# Altium project PASS Capstone.PrjPcb
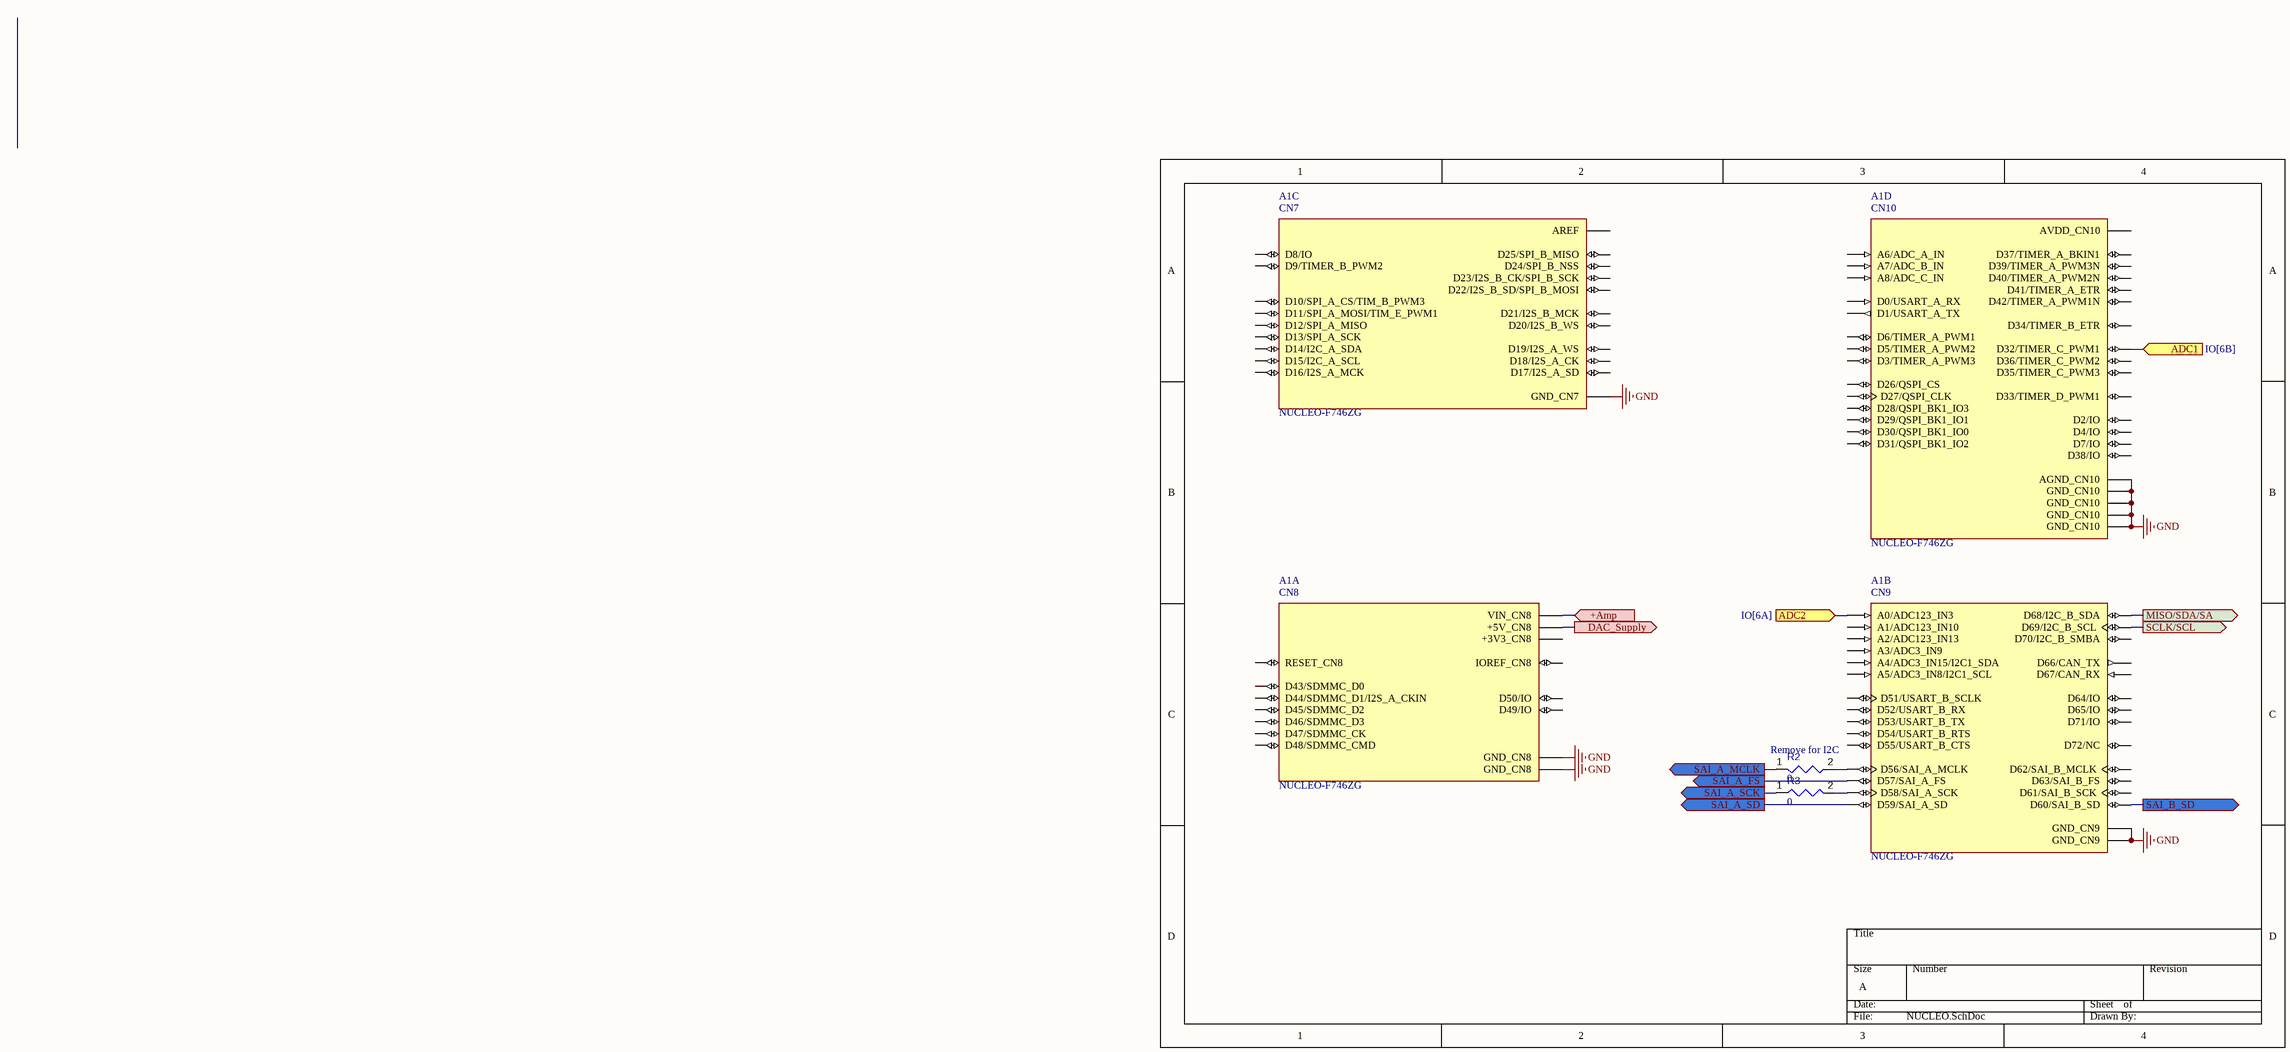
[diagram p0: NUCLEO.SchDoc]
3 sheets, 123 parts. Net scope: flat (ports and power ports of the same name join across sheets).
Board file: PASS Capstone.PcbDoc
Sheets:
  NUCLEO.SchDoc
  DAC.SchDoc
  IO.SchDoc

## Sheet NUCLEO.SchDoc
size A; SheetNumber: 1; SheetTotal: 4

### Parts
A1  NUCLEO-F746ZG  [MODULE_NUCLEO-F746ZG]  (parts A,B,C,D of 4)
R2  value 0  [RESC0603(1608)_L]  (hidden comment: 0Ohm 0603)
R3  0  [RESC0603(1608)_L]

### Ports
+Amp (in, see Amps[1A], Amps[1B], Amps[1C], Amps[1D], Amps[2A], Amps[2B], Amps[2C], Amps[2D], Amps[3A], Amps[3B], Amps[3C], Amps[3D], Amps[4A], Amps[4B], Amps[4C], Amps[4D], Amps[5A], Amps[5B], Amps[5C], Amps[5D], Amps[6A], Amps[6B], Amps[6C], Amps[6D], IO[1B], IO[2B], IO[5A], IO[5B]), ADC1 (in, see IO[6B]), ADC2 (in, see IO[6A]), DAC_Supply (out, see DAC[1D], DAC[4D]), MISO/SDA/SA (out, see DAC[3C], DAC[6C]), SAI_A_FS (out, see DAC[2C], DAC[5C]), SAI_A_MCLK (out, see DAC[1C], DAC[4C]), SAI_A_SCK (out, see DAC[2C], DAC[5C]), SAI_A_SD (out, see DAC[2C]), SAI_B_SD (out, see DAC[5C]), SCLK/SCL (out, see DAC[3C], DAC[6C])

### Nets
GND: A1.CN7_8(GND_CN7) A1.CN8_11(GND_CN8) A1.CN8_13(GND_CN8) A1.CN9_12(GND_CN9) A1.CN9_23(GND_CN9) A1.CN10_3(AGND_CN10) A1.CN10_5(GND_CN10) A1.CN10_17(GND_CN10) A1.CN10_22(GND_CN10) A1.CN10_27(GND_CN10)
NetA1_CN8_9: A1.CN8_9(+5V_CN8) ; port DAC_Supply
NetA1_CN8_15: A1.CN8_15(VIN_CN8) ; port +Amp
NetA1_CN9_1: A1.CN9_1(A0/ADC123_IN3) ; port ADC2
NetA1_CN9_14: A1.CN9_14(D56/SAI_A_MCLK) R2.2
NetA1_CN9_16: A1.CN9_16(D57/SAI_A_FS) ; port SAI_A_FS
NetA1_CN9_18: A1.CN9_18(D58/SAI_A_SCK) R3.2
NetA1_CN9_19: A1.CN9_19(D69/I2C_B_SCL) ; port SCLK/SCL
NetA1_CN9_20: A1.CN9_20(D59/SAI_A_SD) ; port SAI_A_SD
NetA1_CN9_21: A1.CN9_21(D68/I2C_B_SDA) ; port MISO/SDA/SA
NetA1_CN9_22: A1.CN9_22(D60/SAI_B_SD) ; port SAI_B_SD
NetA1_CN10_29: A1.CN10_29(D32/TIMER_C_PWM1) ; port ADC1
NetR2_1: R2.1 ; port SAI_A_MCLK
NetR3_1: R3.1 ; port SAI_A_SCK

Not connected (* = marked no-connect by the designer): A1 CN7_1(D16/I2S_A_MCK) CN7_2(D15/I2C_A_SCL) CN7_3(D17/I2S_A_SD) CN7_4(D14/I2C_A_SDA) CN7_5(D18/I2S_A_CK) CN7_6(AREF) CN7_7(D19/I2S_A_WS) CN7_9(D20/I2S_B_WS) CN7_10(D13/SPI_A_SCK) CN7_11(D21/I2S_B_MCK) CN7_12(D12/SPI_A_MISO) CN7_13(D22/I2S_B_SD/SPI_B_MOSI) CN7_14(D11/SPI_A_MOSI/TIM_E_PWM1) CN7_15(D23/I2S_B_CK/SPI_B_SCK) CN7_16(D10/SPI_A_CS/TIM_B_PWM3) CN7_17(D24/SPI_B_NSS) CN7_18(D9/TIMER_B_PWM2) CN7_19(D25/SPI_B_MISO) CN7_20(D8/IO) CN8_2(D43/SDMMC_D0) CN8_3(IOREF_CN8) CN8_4(D44/SDMMC_D1/I2S_A_CKIN) CN8_5(RESET_CN8) CN8_6(D45/SDMMC_D2) CN8_7(+3V3_CN8) CN8_8(D46/SDMMC_D3) CN8_10(D47/SDMMC_CK) CN8_12(D48/SDMMC_CMD) CN8_14(D49/IO) CN8_16(D50/IO) CN9_2(D51/USART_B_SCLK) CN9_3(A1/ADC123_IN10) CN9_4(D52/USART_B_RX) CN9_5(A2/ADC123_IN13) CN9_6(D53/USART_B_TX) CN9_7(A3/ADC3_IN9) CN9_8(D54/USART_B_RTS) CN9_9(A4/ADC3_IN15/I2C1_SDA) CN9_10(D55/USART_B_CTS) CN9_11(A5/ADC3_IN8/I2C1_SCL) CN9_13(D72/NC) CN9_15(D71/IO) CN9_17(D70/I2C_B_SMBA) CN9_24(D61/SAI_B_SCK) CN9_25(D67/CAN_RX) CN9_26(D62/SAI_B_MCLK) CN9_27(D66/CAN_TX) CN9_28(D63/SAI_B_FS) CN9_29(D65/IO) CN9_30(D64/IO) CN10_1(AVDD_CN10) CN10_2(D7/IO) CN10_4(D6/TIMER_A_PWM1) CN10_6(D5/TIMER_A_PWM2) CN10_7(A6/ADC_A_IN) CN10_8(D4/IO) CN10_9(A7/ADC_B_IN) CN10_10(D3/TIMER_A_PWM3) CN10_11(A8/ADC_C_IN) CN10_12(D2/IO) CN10_13(D26/QSPI_CS) CN10_14(D1/USART_A_TX) CN10_15(D27/QSPI_CLK) CN10_16(D0/USART_A_RX) CN10_18(D42/TIMER_A_PWM1N) CN10_19(D28/QSPI_BK1_IO3) CN10_20(D41/TIMER_A_ETR) CN10_21(D29/QSPI_BK1_IO1) CN10_23(D30/QSPI_BK1_IO0) CN10_24(D40/TIMER_A_PWM2N) CN10_25(D31/QSPI_BK1_IO2) CN10_26(D39/TIMER_A_PWM3N) CN10_28(D38/IO) CN10_30(D37/TIMER_A_BKIN1) CN10_31(D33/TIMER_D_PWM1) CN10_32(D36/TIMER_C_PWM2) CN10_33(D34/TIMER_B_ETR) CN10_34(D35/TIMER_C_PWM3)

### Notes on the sheet
- (near R2) Remove for I2C
- (in symbol NUCLEO-F746ZG, part A) CN8
- (in symbol NUCLEO-F746ZG, part B) CN9
- (in symbol NUCLEO-F746ZG, part C) CN7
- (in symbol NUCLEO-F746ZG, part D) CN10

### Library data of the parts
A1 = NUCLEO-F746ZG: STM32F746ZG, mbed-Enabled Development Nucleo-144 STM32F7 ARMÂ® CortexÂ®-M7 MCU 32-Bit Embedded Evaluation Board; MF: STMicroelectronics; SnapEDA_Link: https://www.snapeda.com/parts/NUCLEO-F746ZG/STMicroelectronics/view-part/531935/?ref=snap; Price: None; Check_prices: https://www.snapeda.com/parts/NUCLEO-F746ZG/STMicroelectronics/view-part/531935/?ref=eda; Value: *; Package: None; Availability: Warning; Purchase-URL: https://pricing.snapeda.com/search/part/NUCLEO-F746ZG/?ref=eda; MP: NUCLEO-F746ZG
R2 = CMP-009-00175-3: Pins: 2; Min Operating Temperature: -55°C; Max Operating Temperature: 155°C; Case/Package: 0603
R3 = CMP-009-00175-3: 0ohm 0603; Pins: 2; Min Operating Temperature: -55°C; Max Operating Temperature: 155°C; Case/Package: 0603; Value: 0

## Sheet DAC.SchDoc
size 635 x 241 mm; SheetNumber: 2; SheetTotal: 4
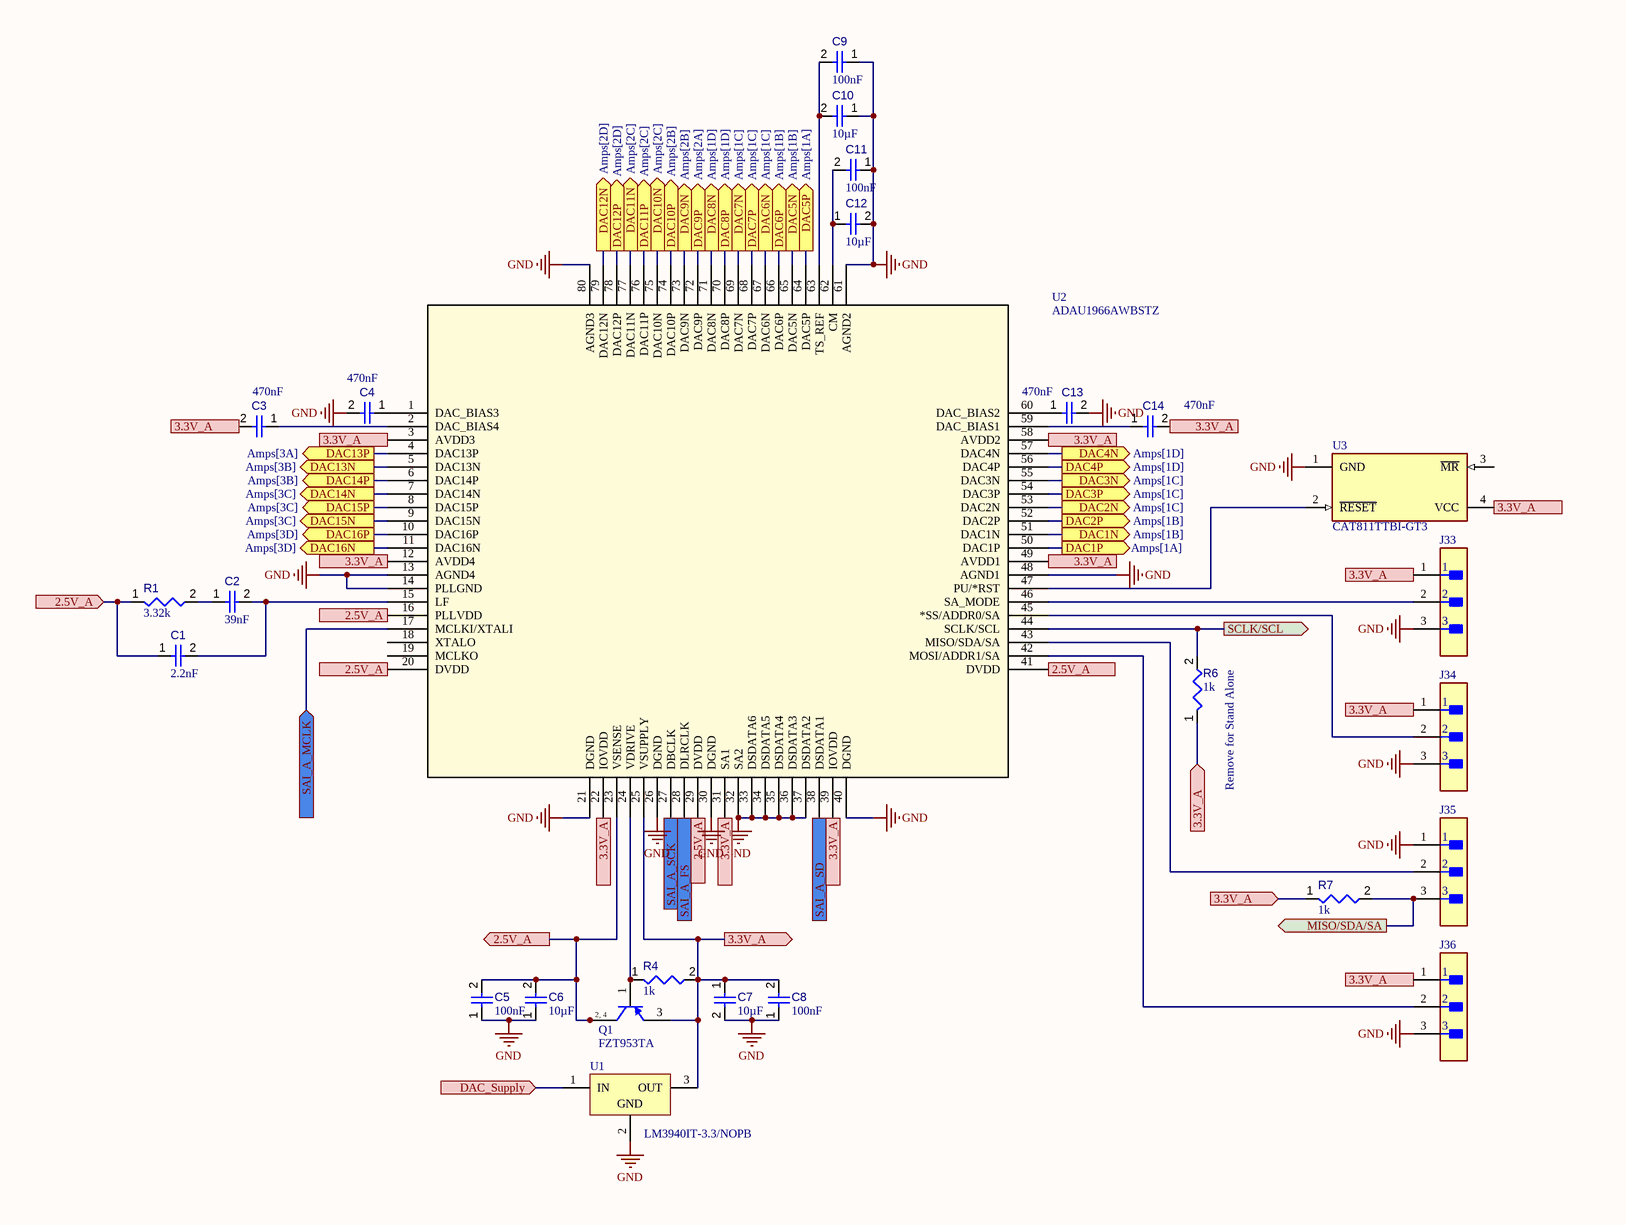
[diagram p1: DAC.SchDoc, left]
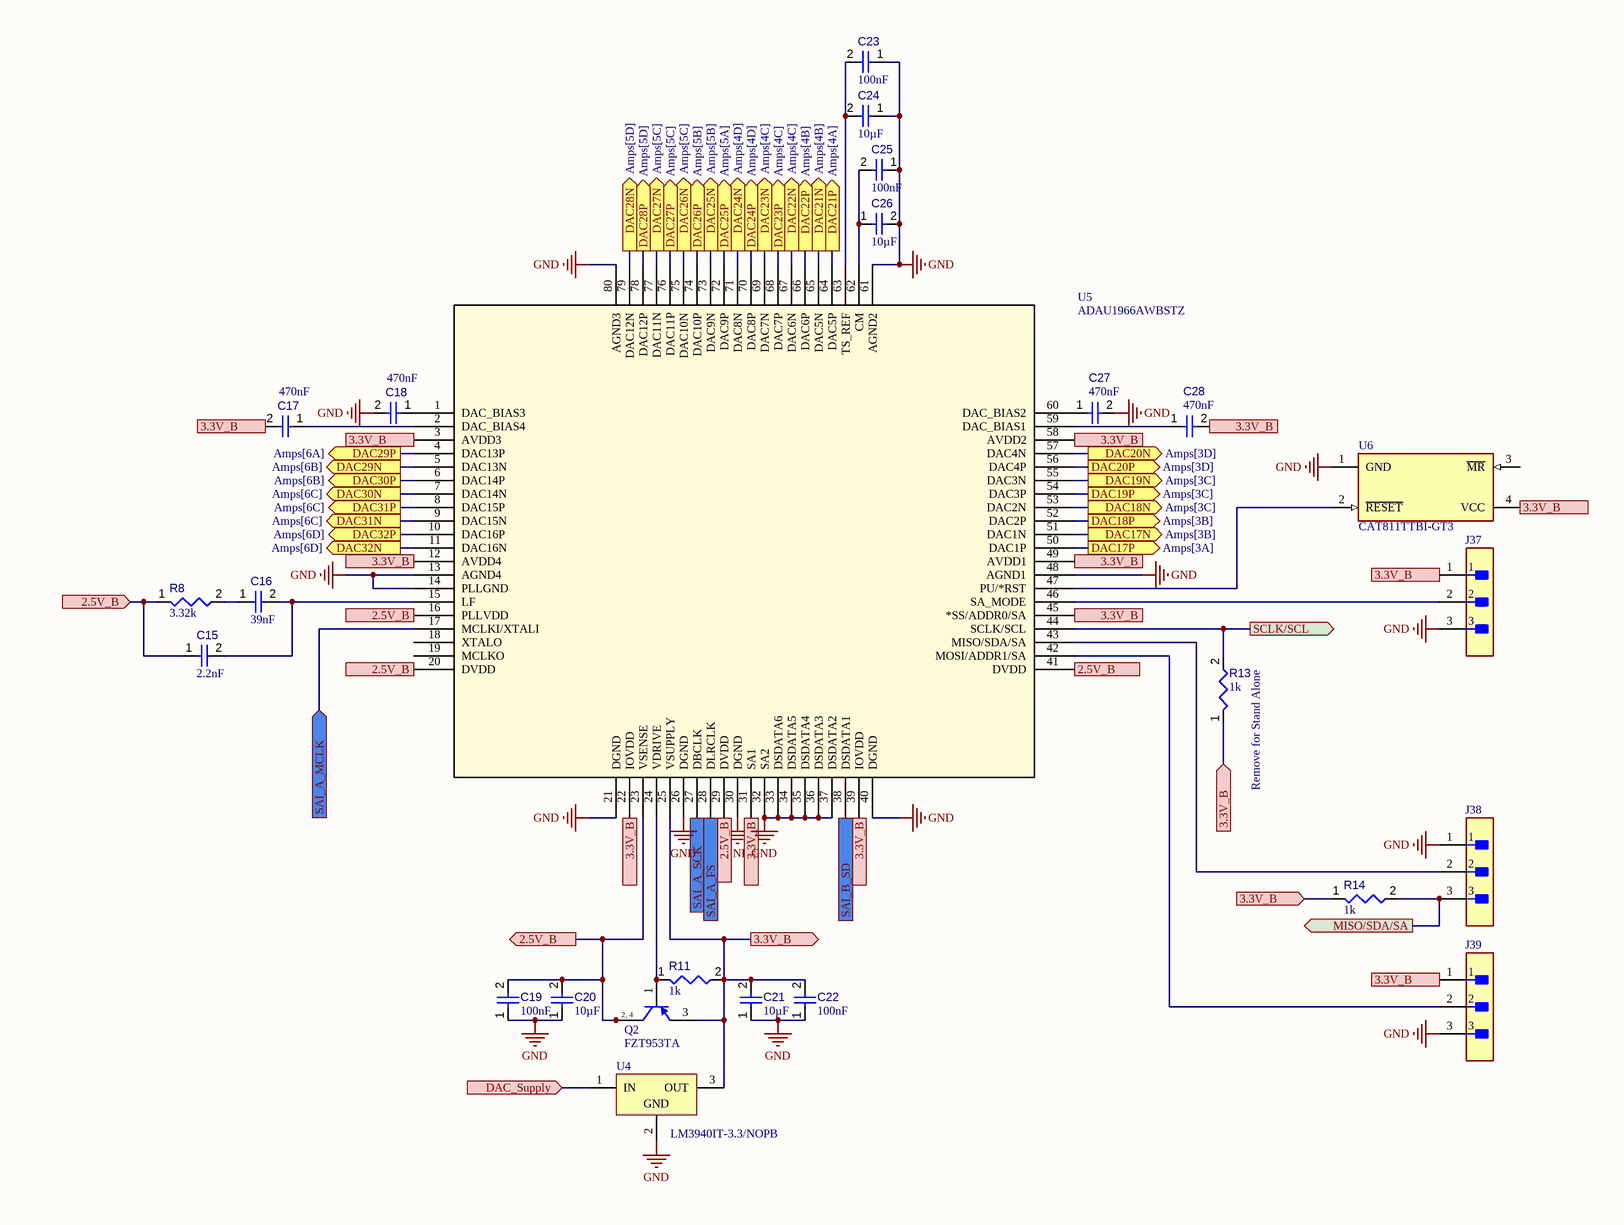
[diagram p2: DAC.SchDoc, right]

### Parts
C1  value 2.2nF  [CAPC0603(1608)100_L]  (hidden comment: Capacitor 2.2nF 0603,, 6V)
C2  value 39nF  [CAPC0805(2012)145_L]  (hidden comment: Capacitor 39nF 0805, 6V)
C3  value 470nF  [CAPC0603(1608)100_L]  (hidden comment: , 6V)
C4  value 470nF  [CAPC0603(1608)100_L]  (hidden comment: Capacitor 470nF 0603, 6V)
C5  value 100nF  [CAPC0603(1608)100_L]  (hidden comment: Capacitor 100nF 0603, 6V)
C6  value 10µF  [CAPC0805(2012)145_L]  (hidden comment: Capacitor 10µF 0805, 6V)
C7  value 10µF  [CAPC0805(2012)145_L]  (hidden comment: Capacitor 10µF 0805, 6V)
C8  value 100nF  [CAPC0603(1608)100_L]  (hidden comment: Capacitor 100nF 0603, 6V)
C9  value 100nF  [CAPC0603(1608)100_L]  (hidden comment: Capacitor 100nF 0603, 6V)
C10  value 10µF  [CAPC0805(2012)145_L]  (hidden comment: Capacitor 10µF 0805, 6V)
C11  value 100nF  [CAPC0603(1608)100_L]  (hidden comment: Capacitor 100nF 0603, 6V)
C12  value 10µF  [CAPC0805(2012)145_L]  (hidden comment: Capacitor 10µF 0805, 6V)
C13  value 470nF  [CAPC0603(1608)100_L]  (hidden comment: Capacitor 470nF 0603, 6V)
C14  value 470nF  [CAPC0603(1608)100_L]  (hidden comment: Capacitor 470nF 0603, 6V)
C15  value 2.2nF  [CAPC0603(1608)100_L]  (hidden comment: Capacitor 2.2nF 0603, 6V)
C16  value 39nF  [CAPC0805(2012)145_L]  (hidden comment: Capacitor 39nF 0805, 6V)
C17  value 470nF  [CAPC0603(1608)100_L]  (hidden comment: Capacitor 470nF +/-20% 25V 0603, 6V)
C18  value 470nF  [CAPC0603(1608)100_L]  (hidden comment: Capacitor 470nF +/-20% 25V 0603, 6V)
C19  value 100nF  [CAPC0603(1608)100_L]  (hidden comment: Capacitor 100nF 0603, 6V)
C20  value 10µF  [CAPC0805(2012)145_L]  (hidden comment: Capacitor 10µF 0805, 6V)
C21  value 10µF  [CAPC0805(2012)145_L]  (hidden comment: Capacitor 10µF 0805, 6V)
C22  value 100nF  [CAPC0603(1608)100_L]  (hidden comment: Capacitor 100nF 0603, 6V)
C23  value 100nF  [CAPC0603(1608)100_L]  (hidden comment: Capacitor 100nF 0603, 6V)
C24  value 10µF  [CAPC0805(2012)145_L]  (hidden comment: Capacitor 10µF 0805, 6V)
C25  value 100nF  [CAPC0603(1608)100_L]  (hidden comment: Capacitor 100nF 0603)
C26  value 10µF  [CAPC0805(2012)145_L]  (hidden comment: Capacitor 10µF 0805, 6V)
C27  value 470nF  [CAPC0603(1608)100_L]  (hidden comment: Capacitor 470nF 0603, 6V)
C28  value 470nF  [CAPC0603(1608)100_L]  (hidden comment: Capacitor 470nF 0603, 6V)
J33  87224-3  [FP-87224-3-MFG]  (value not drawn)
J34  87224-3  [FP-87224-3-MFG]  (value not drawn)
J35  87224-3  [FP-87224-3-MFG]  (value not drawn)
J36  87224-3  [FP-87224-3-MFG]  (value not drawn)
J37  87224-3  [FP-87224-3-MFG]  (value not drawn)
J38  87224-3  [FP-87224-3-MFG]  (value not drawn)
J39  87224-3  [FP-87224-3-MFG]  (value not drawn)
Q1  FZT953TA  [DIOD-SOT223-4_V]
Q2  FZT953TA  [DIOD-SOT223-4_V]
R1  value 3.32k  [RESC0603(1608)_L]  (hidden comment: Resistor 3.32k 0603 , 6V)
R4  value 1k  [RESC0603(1608)_L]  (hidden comment: Resistor 1k 0603, 6V)
R6  value 1k  [RESC0603(1608)_L]  (hidden comment: Resistor 1k 0603, 6V)
R7  value 1k  [RESC0603(1608)_L]  (hidden comment: Ressitor 1k 0603, 6V)
R8  value 3.32k  [RESC0603(1608)_L]  (hidden comment: Resistor 3.32k 0603, 6V)
R11  value 1k  [RESC0603(1608)_L]  (hidden comment: , 6V)
R13  value 1k  [RESC0603(1608)_L]  (hidden comment: Resistor 1k 0603, 6V)
R14  value 1k  [RESC0603(1608)_L]  (hidden comment: Resistor 1k 0603, 6V)
U1  LM3940IT-3.3/NOPB  [NDE0003A]
U2  ADAU1966AWBSTZ  [ST_80_2_ADI]
U3  CAT811TTBI-GT3  [FP-527AF-01-IPC_C]
U4  LM3940IT-3.3/NOPB  [NDE0003A]
U5  ADAU1966AWBSTZ  [ST_80_2_ADI]
U6  CAT811TTBI-GT3  [FP-527AF-01-IPC_C]

### Ports
2.5V_A (in, see DAC[1B], DAC[1C], DAC[1D], DAC[2C]), 2.5V_A (in, see DAC[1C], DAC[1D], DAC[2C]), 2.5V_A (out, see DAC[1B], DAC[1C], DAC[2C]), 2.5V_B (in, see DAC[4B], DAC[4C], DAC[4D], DAC[5C]), 2.5V_B (in, see DAC[4C], DAC[4D], DAC[5C]), 2.5V_B (out, see DAC[4B], DAC[4C], DAC[5C]), 3.3V_A (in, see DAC[1B], DAC[2B], DAC[2C], DAC[2D], DAC[3B], DAC[3C], DAC[3D], IO[6A]), 3.3V_A (in, see DAC[1B], DAC[2B], DAC[2C], DAC[2D], DAC[3B], DAC[3C], IO[6A]), 3.3V_A (out, see DAC[1B], DAC[2B], DAC[2C], DAC[3B], DAC[3C], DAC[3D], IO[6A]), 3.3V_B (in, see DAC[4B], DAC[5B], DAC[5C], DAC[5D], DAC[6B], DAC[6C], DAC[6D], IO[6C]), 3.3V_B (in, see DAC[4B], DAC[5B], DAC[5C], DAC[5D], DAC[6B], DAC[6C], IO[6C]), 3.3V_B (out, see DAC[4B], DAC[5B], DAC[5C], DAC[6B], DAC[6C], DAC[6D], IO[6C]), DAC1N (out, see Amps[1B]), DAC1P (out, see Amps[1A]), DAC2N (out, see Amps[1C]), DAC2P (out, see Amps[1B]), DAC3N (out, see Amps[1C]), DAC3P (out, see Amps[1C]), DAC4N (out, see Amps[1D]), DAC4P (out, see Amps[1D]), DAC5N (out, see Amps[1B]), DAC5P (out, see Amps[1A]), DAC6N (out, see Amps[1C]), DAC6P (out, see Amps[1B]), DAC7N (out, see Amps[1C]), DAC7P (out, see Amps[1C]), DAC8N (out, see Amps[1D]), DAC8P (out, see Amps[1D]), DAC9N (out, see Amps[2B]), DAC9P (out, see Amps[2A]), DAC10N (out, see Amps[2C]), DAC10P (out, see Amps[2B]), DAC11N (out, see Amps[2C]), DAC11P (out, see Amps[2C]), DAC12N (out, see Amps[2D]), DAC12P (out, see Amps[2D]), DAC13N (out, see Amps[3B]), DAC13P (out, see Amps[3A]), DAC14N (out, see Amps[3C]), DAC14P (out, see Amps[3B]), DAC15N (out, see Amps[3C]), DAC15P (out, see Amps[3C]), DAC16N (out, see Amps[3D]), DAC16P (out, see Amps[3D]), DAC17N (out, see Amps[3B]), DAC17P (out, see Amps[3A]), DAC18N (out, see Amps[3C]), DAC18P (out, see Amps[3B]), DAC19N (out, see Amps[3C]), DAC19P (out, see Amps[3C]), DAC20N (out, see Amps[3D]), DAC20P (out, see Amps[3D]), DAC21N (out, see Amps[4B]), DAC21P (out, see Amps[4A]), DAC22N (out, see Amps[4C]), DAC22P (out, see Amps[4B]), DAC23N (out, see Amps[4C]), DAC23P (out, see Amps[4C]), DAC24N (out, see Amps[4D]), DAC24P (out, see Amps[4D]), DAC25N (out, see Amps[5B]), DAC25P (out, see Amps[5A]), DAC26N (out, see Amps[5C]), DAC26P (out, see Amps[5B]), DAC27N (out, see Amps[5C]), DAC27P (out, see Amps[5C]), DAC28N (out, see Amps[5D]), DAC28P (out, see Amps[5D]), DAC29N (out, see Amps[6B]), DAC29P (out, see Amps[6A]), DAC30N (out, see Amps[6C]), DAC30P (out, see Amps[6B]), DAC31N (out, see Amps[6C]), DAC31P (out, see Amps[6C]), DAC32N (out, see Amps[6D]), DAC32P (out, see Amps[6D]), DAC_Supply (in, see DAC[1D], NUCLEO[2C]), DAC_Supply (in, see DAC[4D], NUCLEO[2C]), MISO/SDA/SA (out, see DAC[3C], NUCLEO[4C]), MISO/SDA/SA (out, see DAC[6C], NUCLEO[4C]), SAI_A_FS (in, see DAC[2C], NUCLEO[2C]), SAI_A_FS (in, see DAC[5C], NUCLEO[2C]), SAI_A_MCLK (in, see DAC[1C], NUCLEO[2C]), SAI_A_MCLK (in, see DAC[4C], NUCLEO[2C]), SAI_A_SCK (in, see DAC[2C], NUCLEO[2C]), SAI_A_SCK (in, see DAC[5C], NUCLEO[2C]), SAI_A_SD (in, see NUCLEO[2C]), SAI_B_SD (in, see NUCLEO[4C]), SCLK/SCL (out, see DAC[3C], NUCLEO[4C]), SCLK/SCL (out, see DAC[6C], NUCLEO[4C])

### Nets
GND: C4.2 C5.1 C6.1 C7.2 C8.1 C9.1 C10.1 C11.1 C12.2 C13.2 C18.2 C19.1 C20.1 C21.1 C22.1 C23.1 C24.1 C25.1 C26.2 C27.2 J33.3 J34.3 J35.1 J36.3 J37.3 J38.1 J39.3 U1.2(GND) U2.13(AGND4) U2.14(PLLGND) U2.21(DGND) U2.26(DGND) U2.30(DGND) U2.32(SA2) U2.33(DSDATA6) U2.34(DSDATA5) U2.35(DSDATA4) U2.36(DSDATA3) U2.37(DSDATA2) U2.40(DGND) U2.48(AGND1) U2.61(AGND2) U2.80(AGND3) U3.1(GND) U4.2(GND) U5.13(AGND4) U5.14(PLLGND) U5.21(DGND) U5.26(DGND) U5.30(DGND) U5.32(SA2) U5.33(DSDATA6) U5.34(DSDATA5) U5.35(DSDATA4) U5.36(DSDATA3) U5.37(DSDATA2) U5.40(DGND) U5.48(AGND1) U5.61(AGND2) U5.80(AGND3) U6.1(GND)
NetA1_CN8_9: U1.1(IN) U4.1(IN) ; port DAC_Supply
NetA1_CN9_16: U2.28(DLRCLK) U5.28(DLRCLK) ; port SAI_A_FS
NetA1_CN9_19: R6.2 R13.2 U2.44(SCLK/SCL) U5.44(SCLK/SCL) ; port SCLK/SCL
NetA1_CN9_20: U2.38(DSDATA1) ; port SAI_A_SD
NetA1_CN9_21: J35.3 J38.3 R7.2 R14.2 ; port MISO/SDA/SA
NetA1_CN9_22: U5.38(DSDATA1) ; port SAI_B_SD
NetC1_1: C1.1 C5.2 C6.2 Q1.2(C) Q1.4(C) R1.1 U2.16(PLLVDD) U2.20(DVDD) U2.23(VSENSE) U2.29(DVDD) U2.41(DVDD) ; port 2.5V_A
NetC1_2: C1.2 C2.2 U2.15(LF)
NetC2_1: C2.1 R1.2
NetC3_1: C3.1 U2.2(DAC_BIAS4)
NetC3_2: C3.2 C7.1 C8.2 C14.2 J33.1 J34.1 J36.1 Q1.3(E) R4.2 R6.1 R7.1 U1.3(OUT) U2.3(AVDD3) U2.12(AVDD4) U2.22(IOVDD) U2.25(VSUPPLY) U2.31(SA1) U2.39(IOVDD) U2.49(AVDD1) U2.58(AVDD2) U3.4(VCC) ; port 3.3V_A
NetC4_1: C4.1 U2.1(DAC_BIAS3)
NetC9_2: C9.2 C10.2 U2.63(TS_REF)
NetC11_2: C11.2 C12.1 U2.62(CM)
NetC13_1: C13.1 U2.60(DAC_BIAS2)
NetC14_1: C14.1 U2.59(DAC_BIAS1)
NetC15_1: C15.1 C19.2 C20.2 Q2.2(C) Q2.4(C) R8.1 U5.16(PLLVDD) U5.20(DVDD) U5.23(VSENSE) U5.29(DVDD) U5.41(DVDD) ; port 2.5V_B
NetC15_2: C15.2 C16.2 U5.15(LF)
NetC16_1: C16.1 R8.2
NetC17_1: C17.1 U5.2(DAC_BIAS4)
NetC17_2: C17.2 C21.2 C22.2 C28.2 J37.1 J39.1 Q2.3(E) R11.2 R13.1 R14.1 U4.3(OUT) U5.3(AVDD3) U5.12(AVDD4) U5.22(IOVDD) U5.25(VSUPPLY) U5.31(SA1) U5.39(IOVDD) U5.45(*SS/ADDR0/SA) U5.49(AVDD1) U5.58(AVDD2) U6.4(VCC) ; port 3.3V_B
NetC18_1: C18.1 U5.1(DAC_BIAS3)
NetC23_2: C23.2 C24.2 U5.63(TS_REF)
NetC25_2: C25.2 C26.1 U5.62(CM)
NetC27_1: C27.1 U5.60(DAC_BIAS2)
NetC28_1: C28.1 U5.59(DAC_BIAS1)
NetJ33_2: J33.2 U2.46(SA_MODE)
NetJ34_2: J34.2 U2.45(*SS/ADDR0/SA)
NetJ35_2: J35.2 U2.43(MISO/SDA/SA)
NetJ36_2: J36.2 U2.42(MOSI/ADDR1/SA)
NetJ37_2: J37.2 U5.46(SA_MODE)
NetJ38_2: J38.2 U5.43(MISO/SDA/SA)
NetJ39_2: J39.2 U5.42(MOSI/ADDR1/SA)
NetQ1_1: Q1.1(B) R4.1 U2.24(VDRIVE)
NetQ2_1: Q2.1(B) R11.1 U5.24(VDRIVE)
NetR2_1: U2.17(MCLKI/XTALI) U5.17(MCLKI/XTALI) ; port SAI_A_MCLK
NetR3_1: U2.27(DBCLK) U5.27(DBCLK) ; port SAI_A_SCK
NetU2_4: U2.4(DAC13P) ; port DAC13P
NetU2_5: U2.5(DAC13N) ; port DAC13N
NetU2_6: U2.6(DAC14P) ; port DAC14P
NetU2_7: U2.7(DAC14N) ; port DAC14N
NetU2_8: U2.8(DAC15P) ; port DAC15P
NetU2_9: U2.9(DAC15N) ; port DAC15N
NetU2_10: U2.10(DAC16P) ; port DAC16P
NetU2_11: U2.11(DAC16N) ; port DAC16N
NetU2_47: U2.47(PU/*RST) U3.2(~{RESET})
NetU2_50: U2.50(DAC1P) ; port DAC1P
NetU2_51: U2.51(DAC1N) ; port DAC1N
NetU2_52: U2.52(DAC2P) ; port DAC2P
NetU2_53: U2.53(DAC2N) ; port DAC2N
NetU2_54: U2.54(DAC3P) ; port DAC3P
NetU2_55: U2.55(DAC3N) ; port DAC3N
NetU2_56: U2.56(DAC4P) ; port DAC4P
NetU2_57: U2.57(DAC4N) ; port DAC4N
NetU2_64: U2.64(DAC5P) ; port DAC5P
NetU2_65: U2.65(DAC5N) ; port DAC5N
NetU2_66: U2.66(DAC6P) ; port DAC6P
NetU2_67: U2.67(DAC6N) ; port DAC6N
NetU2_68: U2.68(DAC7P) ; port DAC7P
NetU2_69: U2.69(DAC7N) ; port DAC7N
NetU2_70: U2.70(DAC8P) ; port DAC8P
NetU2_71: U2.71(DAC8N) ; port DAC8N
NetU2_72: U2.72(DAC9P) ; port DAC9P
NetU2_73: U2.73(DAC9N) ; port DAC9N
NetU2_74: U2.74(DAC10P) ; port DAC10P
NetU2_75: U2.75(DAC10N) ; port DAC10N
NetU2_76: U2.76(DAC11P) ; port DAC11P
NetU2_77: U2.77(DAC11N) ; port DAC11N
NetU2_78: U2.78(DAC12P) ; port DAC12P
NetU2_79: U2.79(DAC12N) ; port DAC12N
NetU5_4: U5.4(DAC13P) ; port DAC29P
NetU5_5: U5.5(DAC13N) ; port DAC29N
NetU5_6: U5.6(DAC14P) ; port DAC30P
NetU5_7: U5.7(DAC14N) ; port DAC30N
NetU5_8: U5.8(DAC15P) ; port DAC31P
NetU5_9: U5.9(DAC15N) ; port DAC31N
NetU5_10: U5.10(DAC16P) ; port DAC32P
NetU5_11: U5.11(DAC16N) ; port DAC32N
NetU5_47: U5.47(PU/*RST) U6.2(~{RESET})
NetU5_50: U5.50(DAC1P) ; port DAC17P
NetU5_51: U5.51(DAC1N) ; port DAC17N
NetU5_52: U5.52(DAC2P) ; port DAC18P
NetU5_53: U5.53(DAC2N) ; port DAC18N
NetU5_54: U5.54(DAC3P) ; port DAC19P
NetU5_55: U5.55(DAC3N) ; port DAC19N
NetU5_56: U5.56(DAC4P) ; port DAC20P
NetU5_57: U5.57(DAC4N) ; port DAC20N
NetU5_64: U5.64(DAC5P) ; port DAC21P
NetU5_65: U5.65(DAC5N) ; port DAC21N
NetU5_66: U5.66(DAC6P) ; port DAC22P
NetU5_67: U5.67(DAC6N) ; port DAC22N
NetU5_68: U5.68(DAC7P) ; port DAC23P
NetU5_69: U5.69(DAC7N) ; port DAC23N
NetU5_70: U5.70(DAC8P) ; port DAC24P
NetU5_71: U5.71(DAC8N) ; port DAC24N
NetU5_72: U5.72(DAC9P) ; port DAC25P
NetU5_73: U5.73(DAC9N) ; port DAC25N
NetU5_74: U5.74(DAC10P) ; port DAC26P
NetU5_75: U5.75(DAC10N) ; port DAC26N
NetU5_76: U5.76(DAC11P) ; port DAC27P
NetU5_77: U5.77(DAC11N) ; port DAC27N
NetU5_78: U5.78(DAC12P) ; port DAC28P
NetU5_79: U5.79(DAC12N) ; port DAC28N

Not connected (* = marked no-connect by the designer): U2 18(XTALO) 19(MCLKO); U3 3(~{MR}); U5 18(XTALO) 19(MCLKO); U6 3(~{MR})

### Notes on the sheet
- (near R6) Remove for Stand Alone
- (near R13) Remove for Stand Alone
- (in symbol CMP-2000-06302-1) 2, 4

### Library data of the parts
C1 = CMP-001-00077-3: Chip Capacitor, 2.2nF 0603,; Tolerance: 10%; Voltage Rating: 25V; Mounting Technology: SMT; Max Operating Temperature: 85°C; Min Operating Temperature: -55°C; Pins: 2; Case/Package: 0603
C2 = CMP-001-00080-4: Chip Capacitor, 39nF  0805,; Voltage Rating: 25V; Tolerance: 20%; Min Operating Temperature: -55°C; Max Operating Temperature: 85°C; Pins: 2; Mounting Technology: SMT; Case/Package: 0805
C3 C14 C28 = CMP-001-00077-3: Chip Capacitor, 470nF 0603,; Voltage Rating: 25V; Tolerance: 10%; Min Operating Temperature: -55°C; Max Operating Temperature: 85°C; Pins: 2; Mounting Technology: SMT; Case/Package: 0603
C4 = CMP-001-00077-3: Chip Capacitor, 470nF  0603; Voltage Rating: 25V; Tolerance: 10%; Min Operating Temperature: -55°C; Max Operating Temperature: 85°C; Pins: 2; Mounting Technology: SMT; Case/Package: 0603
C5 C8 C19 C22 = CMP-001-00077-3: Chip Capacitor, 100nF 0603,; Voltage Rating: 25V; Tolerance: 10%; Max Operating Temperature: 85°C; Min Operating Temperature: -55°C; Case/Package: 0603; Mounting Technology: SMT; Pins: 2
C6 C10 C12 C20 C21 C24 C26 = CMP-001-00079-4: Chip Capacitor, 10µF 0805,; Voltage Rating: 25V; Tolerance: 10%; Min Operating Temperature: -55°C; Case/Package: 0805; Max Operating Temperature: 85°C; Mounting Technology: SMT; Pins: 2
C7 = CMP-001-00079-4: Chip Capacitor, 10µF 0805; Voltage Rating: 25V; Tolerance: 10%; Min Operating Temperature: -55°C; Case/Package: 0805; Max Operating Temperature: 85°C; Mounting Technology: SMT; Pins: 2
C9 C11 C23 = CMP-001-00075-4: Capacitor 100nF 0603; Voltage Rating: 10V; Tolerance: 10%; Max Operating Temperature: 85°C; Min Operating Temperature: -55°C; Case/Package: 0603; Mounting Technology: SMT; Pins: 2
C13 C27 = CMP-001-00077-3: Chip Capacitor, 470nF  0603,; Voltage Rating: 25V; Tolerance: 10%; Min Operating Temperature: -55°C; Max Operating Temperature: 85°C; Pins: 2; Mounting Technology: SMT; Case/Package: 0603
C15 = CMP-001-00077-3: Chip Capacitor, 2.2nF  0603,; Tolerance: 10%; Voltage Rating: 25V; Mounting Technology: SMT; Max Operating Temperature: 85°C; Min Operating Temperature: -55°C; Pins: 2; Case/Package: 0603
C16 = CMP-001-00080-4: Chip Capacitor, 39nF 0805,; Voltage Rating: 25V; Tolerance: 20%; Min Operating Temperature: -55°C; Max Operating Temperature: 85°C; Pins: 2; Mounting Technology: SMT; Case/Package: 0805
C17 C18 = CMP-001-00077-3: Chip Capacitor, 470nF +/-20%, 25V, 0603, Thickness 1 mm; Tolerance: 10%; Voltage Rating: 25V; Min Operating Temperature: -55°C; Max Operating Temperature: 85°C; Pins: 2; Mounting Technology: SMT; Case/Package: 0603
C25 = CMP-001-00075-4: Voltage Rating: 10V; Tolerance: 10%; Max Operating Temperature: 85°C; Min Operating Temperature: -55°C; Case/Package: 0603; Mounting Technology: SMT; Pins: 2
J33-J39 = CMP-2000-05697-2: CONN HEADER VERT 3POS 2.54MM; Number of Positions: 3; Gasket: No (Without); High Speed Serial Data Connector: No; Current Rating: 3A; Contact Post Length: 0.125inch; PCB Thickness: 1.397mm; PCB Mount Retention: Without; Connector Type: Plug; Approvals: CSA; PCB Mounting Orientation: Vertical; Pitch: 2.54mm; Mating Alignment: No (Without); Housing Color: Black; Contact Gender: Male; Length: 7.21mm; Max Operating Temperature: 105°C; Strain Relief: No (Without); Contact Material: Bronze; Row Spacing: 2.54mm; Series: AMPMODU MOD II; Board Standoff: No (Without); Package Quantity: 520; Radiation Hardening: No; Contact Protection: No (Without); Stabilizers: No (Without); Number of Rows: 1; Contact Mating Length: 8.08mm; Contact Shape: Square; Depth: 2.54mm; Contact Current Rating: 3A; Flammability Rating: UL94 V-0; Packaging: Carton; Number of Contacts: 3; Orientation: Straight; Mount: Through Hole; Keyed: No; Contact Type: Male Pin; Housing Material: Thermoplastic; High Temperature Housing: No; ELV: Compliant; Contact Plating: Gold; Termination: Through Hole; Selectively Loaded: No (Without); Lead Free: Lead Free; Min Operating Temperature: -65°C; Mating Connector Lock: No (Without); Color: Black; RoHS Compliant: Yes
Q1 Q2 = CMP-2000-06302-1: PNP Silicon Planar High Current (high Performance) Transistor, 100 V, 3 W, -55 to 150 degC, 4-Pin SOT223, RoHS, Tape and Reel; Collector- Emitter Voltage VCEO Max: -100V; Configuration: Single; Package Version: 06/2015; DC Collector/Base Gain hfe Min: 15at-10A,-1V; DC Current Gain hFE Max: 100; Collector- Base Voltage VCBO: -140V; Gain Bandwidth Product fT: 125MHz; Maximum DC Collector Current: -10A; Collector-Emitter Saturation Voltage: -420mV; Unit Weight: 0.000282oz; Pd - Power Dissipation: 3W; Brand: DiodesIncorporated; Emitter- Base Voltage VEBO: -7V; Maximum Operating Temperature: +150C; Package Description: 4-Pin Small Outline Transistor, Body 6.5 x 3.5 mm, Pitch 2.3 mm; Package URL: http://www.diodes.com/_files/packages/SOT223.pdf; Datasheet Version: 04/2000; Manufacturer URL: http://www.diodes.com/; Packaging: Reel; Product Category: BipolarTransistors-BJT; Series: FZT953; Mounting Style: SMD/SMT; RoHS: True; Transistor Polarity: PNP; Package Reference: SOT223-4; Package / Case: SOT-223; Datasheet URL: http://www.diodes.com/_files/datasheets/FZT951_FZT953.pdf; Factory Pack Quantity: 1000; Height: 1.65mm(Max); Minimum Operating Temperature: -55C; Width: 3.7mm(Max); Mounting Technology: SurfaceMount; Manufacturer: DiodesIncorporated; Length: 6.7mm(Max)
R1 R8 = CMP-009-00175-3: Resistor 3.32k 0603; Pins: 2; Min Operating Temperature: -55°C; Max Operating Temperature: 155°C; Case/Package: 0603
R4 R6 R13 = CMP-009-00175-3: Resistor1k 0603; Pins: 2; Min Operating Temperature: -55°C; Max Operating Temperature: 155°C; Case/Package: 0603
R7 R11 R14 = CMP-009-00175-3: Resistor 1k 0603; Pins: 2; Min Operating Temperature: -55°C; Max Operating Temperature: 155°C; Case/Package: 0603
U1 U4 = CMP-0062-02467-3: 1A Low Dropout Regulator for 5V to 3.3V Conversion, 3-pin TO-220, Pb-Free; Manufacturer: Texas Instruments; PackageTopMarking: NSUZXYTTE#*LM3940IT*-3.3 P+; CompType: LDO IC; PowerWise: N; PinCount: 3; RoHS: Y; PackageDescription: TO-220, Molded, 3 Lead, Straight; PackageReference: NDE0003A; ComponentLink1URL: http://www.ti.com/general/docs/lit/getliterature.tsp?genericPartNumber=LM3940&fileType=pdf; ComponentLink1Description: Datasheet URL
U2 U5 = ADAU1966AWBSTZ: No Description Available; Mfr_Name: Analog Devices Inc; Copyright: Copyright (C) 2024 Ultra Librarian. All rights reserved.; Manufacturer_Part_Number: ADAU1966AWBSTZ; RefDes: RefDes; Type: DEV
U3 U6 = CMP-07130-000010-1: IC SUPERVISOR 1 CHANNEL SOT143; Manufacturer: ON Semiconductor; Reset Timeout: 240ms; Threshold Voltage: 3.08V; Number Of Outputs: 1; Standoff Height: 0.05mm; Min Supply Voltage: 1V; Max Supply Voltage: 5.5V; Reset Type: Active Low; Max Power Dissipation: 320mW; Output Current: 20mA; Nominal Supply Current: 6-8uA; Device Class L2: Power Management ICs; Mouser Description: Supervisory Circuits Act. Lo w/PB 4-pin; Temperature Range Low: -40°C; Ambient Temperature Range High: +85°C; Category: IC; Device Class L3: Voltage Supervisors; Temperature: -40°C to +85°C; Ambient Temperature Range Low: -40°C; RoHS: TRUE; Number Of Rails Monitored: 1; Height: 1.22mm; Automotive: No; ComponentLink2URL: https://www.onsemi.com/pub/Collateral/CAT811-D.PDF; Octopart: https://octopart.com/cat811ttbi-gt3-on+semiconductor-13128977; ComponentLink2Description: Datasheet; Manufacturer Part Number: CAT811TTBI-GT3; Package: 527AF-01; Lead Free: Yes; Device Class L1: Integrated Circuits (ICs); Temperature Range High: +85°C; Digikey Description: IC SUPERVISOR 1 CHANNEL SOT143; Footprint Url: https://www.onsemi.com/pub/Collateral/527AF.PDF

## Sheet IO.SchDoc
size 228 x 279 mm; SheetNumber: 4; SheetTotal: 4
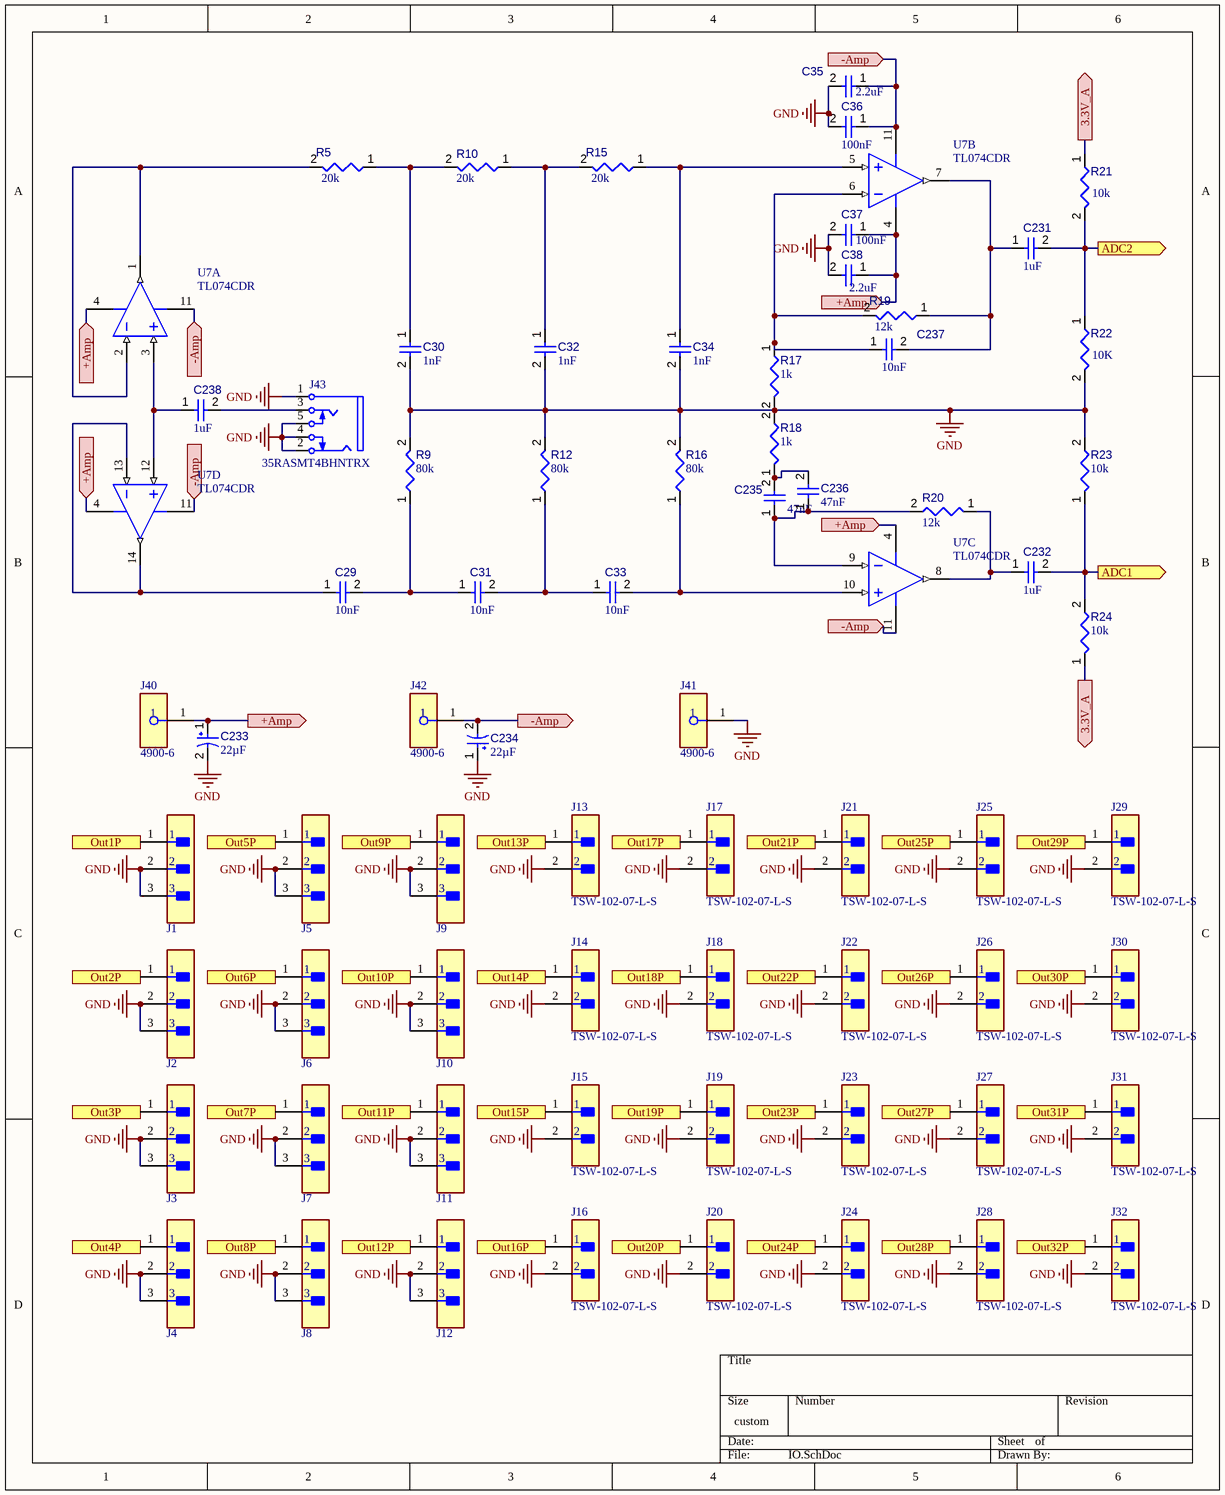
[diagram p3: IO.SchDoc]

### Parts
C29  value 10nF  [CAPC0603(1608)100_L]  (hidden comment: Capacitor 8nF 0603, 12V)
C30  value 1nF  [CAPC0603(1608)100_L]  (hidden comment: Capacitor 1nF 0603, 12V)
C31  value 10nF  [CAPC0603(1608)100_L]  (hidden comment: Capacitor 8nF 0603, 12V)
C32  value 1nF  [CAPC0603(1608)100_L]  (hidden comment: Capacitor 1nF 0603, 12V)
C33  value 10nF  [CAPC0603(1608)100_L]  (hidden comment: Capacitor 10nF 0603, 12V)
C34  value 1nF  [CAPC0603(1608)100_L]  (hidden comment: Capacitor 1nF 0603, 12V)
C35  value 2.2uF  [CAPC0603(1608)100_L]  (hidden comment: Capacitor 2.2uF 0603)
C36  value 100nF  [CAPC0603(1608)100_L]  (hidden comment: Capacitor 100nF 0603)
C37  value 100nF  [CAPC0603(1608)100_L]  (hidden comment: Capacitor 100nF 0603)
C38  value 2.2uF  [CAPC0603(1608)100_L]  (hidden comment: Capacitor 2.2uF 0603)
C231  value 1uF  [CAPC0603(1608)100_L]  (hidden comment: Capacitor 1uF 0603, 12V)
C232  value 1uF  [CAPC0603(1608)100_L]  (hidden comment: Capacitor 1uF 0603, 12V)
C233  value 22µF  [CAPPR55-250-1120X630X1220]  (hidden comment: ECA-2AM220)
C234  value 22µF  [CAPPR55-250-1120X630X1220]  (hidden comment: ECA-2AM220)
C235  value 47nF  [CAPC0603(1608)100_L]  (hidden comment: Capacitor 47nF 0603)
C236  value 47nF  [CAPC0603(1608)100_L]  (hidden comment: Capacitor 47nF 0603)
C237  value 10nF  [CAPC0603(1608)100_L]  (hidden comment: Capacitor 10nF 0603, 12V)
C238  value 1uF  [CAPC0603(1608)100_L]  (hidden comment: Capacitor 1uF 0603, 12V)
J1  87224-3  [FP-87224-3-MFG]  (value not drawn)
J2  87224-3  [FP-87224-3-MFG]  (value not drawn)
J3  87224-3  [FP-87224-3-MFG]  (value not drawn)
J4  87224-3  [FP-87224-3-MFG]  (value not drawn)
J5  87224-3  [FP-87224-3-MFG]  (value not drawn)
J6  87224-3  [FP-87224-3-MFG]  (value not drawn)
J7  87224-3  [FP-87224-3-MFG]  (value not drawn)
J8  87224-3  [FP-87224-3-MFG]  (value not drawn)
J9  87224-3  [FP-87224-3-MFG]  (value not drawn)
J10  87224-3  [FP-87224-3-MFG]  (value not drawn)
J11  87224-3  [FP-87224-3-MFG]  (value not drawn)
J12  87224-3  [FP-87224-3-MFG]  (value not drawn)
J13  TSW-102-07-L-S  [FP-TSW-102-07-L-S-MFG]
J14  TSW-102-07-L-S  [FP-TSW-102-07-L-S-MFG]
J15  TSW-102-07-L-S  [FP-TSW-102-07-L-S-MFG]
J16  TSW-102-07-L-S  [FP-TSW-102-07-L-S-MFG]
J17  TSW-102-07-L-S  [FP-TSW-102-07-L-S-MFG]
J18  TSW-102-07-L-S  [FP-TSW-102-07-L-S-MFG]
J19  TSW-102-07-L-S  [FP-TSW-102-07-L-S-MFG]
J20  TSW-102-07-L-S  [FP-TSW-102-07-L-S-MFG]
J21  TSW-102-07-L-S  [FP-TSW-102-07-L-S-MFG]
J22  TSW-102-07-L-S  [FP-TSW-102-07-L-S-MFG]
J23  TSW-102-07-L-S  [FP-TSW-102-07-L-S-MFG]
J24  TSW-102-07-L-S  [FP-TSW-102-07-L-S-MFG]
J25  TSW-102-07-L-S  [FP-TSW-102-07-L-S-MFG]
J26  TSW-102-07-L-S  [FP-TSW-102-07-L-S-MFG]
J27  TSW-102-07-L-S  [FP-TSW-102-07-L-S-MFG]
J28  TSW-102-07-L-S  [FP-TSW-102-07-L-S-MFG]
J29  TSW-102-07-L-S  [FP-TSW-102-07-L-S-MFG]
J30  TSW-102-07-L-S  [FP-TSW-102-07-L-S-MFG]
J31  TSW-102-07-L-S  [FP-TSW-102-07-L-S-MFG]
J32  TSW-102-07-L-S  [FP-TSW-102-07-L-S-MFG]
J40  4900-6  [FP-4900-6-MFG]
J41  4900-6  [FP-4900-6-MFG]
J42  4900-6  [FP-4900-6-MFG]
J43  35RASMT4BHNTRX  [SWIT-35RASMT4BHNTRX_V]
R5  value 20k  [RESC0603(1608)_L]  (hidden comment: Resistor 20k 0603, 12V)
R9  value 80k  [RESC0603(1608)_L]  (hidden comment: Resistor 80k 0603, 12V)
R10  value 20k  [RESC0603(1608)_L]  (hidden comment: Resistor 20k 0603, 12V)
R12  value 80k  [RESC0603(1608)_L]  (hidden comment: Resistor 80k 0603, 12V)
R15  value 20k  [RESC0603(1608)_L]  (hidden comment: Resistor 20k 0603, 12V)
R16  value 80k  [RESC0603(1608)_L]  (hidden comment: Resistor 80k 0603, 12V)
R17  value 1k  [RESC0603(1608)_L]  (hidden comment: Resistor 1k 0603, 12V)
R18  value 1k  [RESC0603(1608)_L]  (hidden comment: Resistor 1k 0603, 12V)
R19  value 12k  [RESC0603(1608)_L]  (hidden comment: Resistor 12k 0603, 12V)
R20  value 12k  [RESC0603(1608)_L]  (hidden comment: Resistor 12k 0603, 12V)
R21  value 10k  [RESC0603(1608)_L]  (hidden comment: Resistor 10k 0603, 12V)
R22  value 10K  [RESC0603(1608)_L]  (hidden comment: Resistor 10k 0603, 12V)
R23  value 10k  [RESC0603(1608)_L]  (hidden comment: Resistor 10k 0603, 12V)
R24  value 10k  [RESC0603(1608)_L]  (hidden comment: Resistor 10k 0603, 12V)
U7  TL074CDR  [D0014A_N]  (parts A,B,C,D of 4)

### Ports
3.3V_A (out, see DAC[1B], DAC[2B], DAC[2C], DAC[2D], DAC[3B], DAC[3C], DAC[3D], IO[6A]), 3.3V_A (out, see DAC[1B], DAC[2B], DAC[2C], DAC[2D], DAC[3B], DAC[3C], DAC[3D], IO[6C]), +Amp (in, see Amps[1A], Amps[1B], Amps[1C], Amps[1D], Amps[2A], Amps[2B], Amps[2C], Amps[2D], Amps[3A], Amps[3B], Amps[3C], Amps[3D], Amps[4A], Amps[4B], Amps[4C], Amps[4D], Amps[5A], Amps[5B], Amps[5C], Amps[5D], Amps[6A], Amps[6B], Amps[6C], Amps[6D], IO[1B], IO[2B], IO[5A], IO[5B], NUCLEO[2C]), +Amp (in, see Amps[1A], Amps[1B], Amps[1C], Amps[1D], Amps[2A], Amps[2B], Amps[2C], Amps[2D], Amps[3A], Amps[3B], Amps[3C], Amps[3D], Amps[4A], Amps[4B], Amps[4C], Amps[4D], Amps[5A], Amps[5B], Amps[5C], Amps[5D], Amps[6A], Amps[6B], Amps[6C], Amps[6D], IO[1B], IO[2B], IO[5A], NUCLEO[2C]), +Amp (in, see Amps[1A], Amps[1B], Amps[1C], Amps[1D], Amps[2A], Amps[2B], Amps[2C], Amps[2D], Amps[3A], Amps[3B], Amps[3C], Amps[3D], Amps[4A], Amps[4B], Amps[4C], Amps[4D], Amps[5A], Amps[5B], Amps[5C], Amps[5D], Amps[6A], Amps[6B], Amps[6C], Amps[6D], IO[1B], IO[2B], IO[5B], NUCLEO[2C]), +Amp (out, see Amps[1A], Amps[1B], Amps[1C], Amps[1D], Amps[2A], Amps[2B], Amps[2C], Amps[2D], Amps[3A], Amps[3B], Amps[3C], Amps[3D], Amps[4A], Amps[4B], Amps[4C], Amps[4D], Amps[5A], Amps[5B], Amps[5C], Amps[5D], Amps[6A], Amps[6B], Amps[6C], Amps[6D], IO[1B], IO[5A], IO[5B], NUCLEO[2C]), -Amp (in, see Amps[1A], Amps[1B], Amps[1C], Amps[1D], Amps[2A], Amps[2B], Amps[2C], Amps[2D], Amps[3A], Amps[3B], Amps[3C], Amps[3D], Amps[4A], Amps[4B], Amps[4C], Amps[4D], Amps[5A], Amps[5B], Amps[5C], Amps[5D], Amps[6A], Amps[6B], Amps[6C], Amps[6D], IO[1B], IO[3B], IO[5A]), -Amp (in, see Amps[1A], Amps[1B], Amps[1C], Amps[1D], Amps[2A], Amps[2B], Amps[2C], Amps[2D], Amps[3A], Amps[3B], Amps[3C], Amps[3D], Amps[4A], Amps[4B], Amps[4C], Amps[4D], Amps[5A], Amps[5B], Amps[5C], Amps[5D], Amps[6A], Amps[6B], Amps[6C], Amps[6D], IO[1B], IO[3B], IO[5A], IO[5B]), -Amp (in, see Amps[1A], Amps[1B], Amps[1C], Amps[1D], Amps[2A], Amps[2B], Amps[2C], Amps[2D], Amps[3A], Amps[3B], Amps[3C], Amps[3D], Amps[4A], Amps[4B], Amps[4C], Amps[4D], Amps[5A], Amps[5B], Amps[5C], Amps[5D], Amps[6A], Amps[6B], Amps[6C], Amps[6D], IO[1B], IO[3B], IO[5B]), -Amp (out, see Amps[1A], Amps[1B], Amps[1C], Amps[1D], Amps[2A], Amps[2B], Amps[2C], Amps[2D], Amps[3A], Amps[3B], Amps[3C], Amps[3D], Amps[4A], Amps[4B], Amps[4C], Amps[4D], Amps[5A], Amps[5B], Amps[5C], Amps[5D], Amps[6A], Amps[6B], Amps[6C], Amps[6D], IO[1B], IO[5A], IO[5B]), ADC1 (out, see NUCLEO[4A]), ADC2 (out, see NUCLEO[3C]), Out1P (in, see Amps[1A]), Out2P (in, see Amps[1B]), Out3P (in, see Amps[1C]), Out4P (in, see Amps[1D]), Out5P (in, see Amps[2A]), Out6P (in, see Amps[2B]), Out7P (in, see Amps[2C]), Out8P (in, see Amps[2D]), Out9P (in, see Amps[3A]), Out10P (in, see Amps[3B]), Out11P (in, see Amps[3C]), Out12P (in, see Amps[3D]), Out13P (in, see Amps[3A]), Out14P (in, see Amps[3B]), Out15P (in, see Amps[3C]), Out16P (in, see Amps[3D]), Out17P (in, see Amps[4A]), Out18P (in, see Amps[4B]), Out19P (in, see Amps[4C]), Out20P (in, see Amps[4D]), Out21P (in, see Amps[5A]), Out22P (in, see Amps[5B]), Out23P (in, see Amps[5C]), Out24P (in, see Amps[5D]), Out25P (in, see Amps[6A]), Out26P (in, see Amps[6B]), Out27P (in, see Amps[6C]), Out28P (in, see Amps[6D]), Out29P (in, see Amps[6A]), Out30P (in, see Amps[6B]), Out31P (in, see Amps[6C]), Out32P (in, see Amps[6D])

### Nets
GND: C30.2 C32.2 C34.2 C35.2 C36.2 C37.2 C38.2 C233.2 C234.1 J1.2 J1.3 J2.2 J2.3 J3.2 J3.3 J4.2 J4.3 J5.2 J5.3 J6.2 J6.3 J7.2 J7.3 J8.2 J8.3 J9.2 J9.3 J10.2 J10.3 J11.2 J11.3 J12.2 J12.3 J13.2 J14.2 J15.2 J16.2 J17.2 J18.2 J19.2 J20.2 J21.2 J22.2 J23.2 J24.2 J25.2 J26.2 J27.2 J28.2 J29.2 J30.2 J31.2 J32.2 J41.1 J43.1 J43.2 J43.4 J43.5 R9.2 R12.2 R16.2 R17.2 R18.2 R22.2 R23.2
NetA1_CN8_15: C37.1 C38.1 C233.1 J40.1 U7.4(VCC+) ; port +Amp
NetA1_CN9_1: C231.2 R21.2 R22.1 ; port ADC2
NetA1_CN10_29: C232.2 R23.1 R24.2 ; port ADC1
NetC3_2: R21.1 R24.1 ; port 3.3V_A
NetC29_1: C29.1 U7.13(IN4-) U7.14(OUT4)
NetC29_2: C29.2 C31.1 R9.1
NetC30_1: C30.1 R5.1 R10.2
NetC31_2: C31.2 C33.1 R12.1
NetC32_1: C32.1 R10.1 R15.2
NetC33_2: C33.2 R16.1 U7.10(IN3+)
NetC34_1: C34.1 R15.1 U7.5(IN2+)
NetC35_1: C35.1 C36.1 C234.2 J42.1 U7.11(VCC-) ; port -Amp
NetC231_1: C231.1 C237.2 R19.1 U7.7(OUT2)
NetC232_1: C232.1 R20.1 U7.8(OUT3)
NetC235_1: C235.1 C236.1 R20.2 U7.9(IN3-)
NetC235_2: C235.2 C236.2 R18.1
NetC237_1: C237.1 R17.1 R19.2 U7.6(IN2-)
NetC238_1: C238.1 U7.3(IN1+) U7.12(IN4+)
NetC238_2: C238.2 J43.3
NetJ1_1: J1.1 ; port Out1P
NetJ2_1: J2.1 ; port Out2P
NetJ3_1: J3.1 ; port Out3P
NetJ4_1: J4.1 ; port Out4P
NetJ5_1: J5.1 ; port Out5P
NetJ6_1: J6.1 ; port Out6P
NetJ7_1: J7.1 ; port Out7P
NetJ8_1: J8.1 ; port Out8P
NetJ9_1: J9.1 ; port Out9P
NetJ10_1: J10.1 ; port Out10P
NetJ11_1: J11.1 ; port Out11P
NetJ12_1: J12.1 ; port Out12P
NetJ13_1: J13.1 ; port Out13P
NetJ14_1: J14.1 ; port Out14P
NetJ15_1: J15.1 ; port Out15P
NetJ16_1: J16.1 ; port Out16P
NetJ17_1: J17.1 ; port Out17P
NetJ18_1: J18.1 ; port Out18P
NetJ19_1: J19.1 ; port Out19P
NetJ20_1: J20.1 ; port Out20P
NetJ21_1: J21.1 ; port Out21P
NetJ22_1: J22.1 ; port Out22P
NetJ23_1: J23.1 ; port Out23P
NetJ24_1: J24.1 ; port Out24P
NetJ25_1: J25.1 ; port Out25P
NetJ26_1: J26.1 ; port Out26P
NetJ27_1: J27.1 ; port Out27P
NetJ28_1: J28.1 ; port Out28P
NetJ29_1: J29.1 ; port Out29P
NetJ30_1: J30.1 ; port Out30P
NetJ31_1: J31.1 ; port Out31P
NetJ32_1: J32.1 ; port Out32P
NetR5_2: R5.2 U7.1(OUT1) U7.2(IN1-)

### Library data of the parts
C29 C31 C33 C237 = CMP-001-00075-4: 8nF Cap 0603; Voltage Rating: 10V; Tolerance: 10%; Max Operating Temperature: 85°C; Min Operating Temperature: -55°C; Case/Package: 0603; Mounting Technology: SMT; Pins: 2
C30 C32 C34 = CMP-001-00075-4: 1nF 0603; Voltage Rating: 10V; Tolerance: 10%; Max Operating Temperature: 85°C; Min Operating Temperature: -55°C; Case/Package: 0603; Mounting Technology: SMT; Pins: 2
C35-C38 C235 C236 = CMP-001-00078-4: Tolerance: 10%; Voltage Rating: 50V; Case/Package: 0603; Pins: 2; Max Operating Temperature: 85°C; Mounting Technology: SMT; Min Operating Temperature: -55°C
C231 C232 C238 = CMP-001-00075-4: 1uF 0603; Voltage Rating: 10V; Tolerance: 10%; Max Operating Temperature: 85°C; Min Operating Temperature: -55°C; Case/Package: 0603; Mounting Technology: SMT; Pins: 2
C233 C234 = CMP-001-00035-7: Aluminum Electrolytic Capacitor, 22 uF, +/- 20%, 100 V, -40 to 85 degC, 2-Pin THD, RoHS, Bulk; Manufacturer: Panasonic; Voltage Rating: 100V; Ripple Current: 115mA; Manufacturer URL: http://www.panasonic.com/; Packaging: Bulk; Package Description: 2-Pin Radial Lead, Dia 6.3 mm, Height 12.2 mm; Datasheet URL: https://industrial.panasonic.com/cdbs/www-data/pdf/RDF0000/ABA0000C1047.pdf; RoHS Compliant: True; Package Quantity: 200; Case/Package: Radial; Package Reference: CAPPR55-250-1120X630X1220; Datasheet Version: Mar-16; Pins: 2; Tolerance: 20%; Diameter: 6.3mm; Max Operating Temperature: 85°C; Ripple Current (AC): 115mA; Capacitor Type: Electrolytic; Mounting Technology: TH; Min Operating Temperature: -40°C; Lead Pitch: 2.5mm
J1-J12 = CMP-2000-05697-2: as J33 on sheet DAC; Pitch: 2.54mm; Mating Alignment: No (Without); Housing Color: Black; Contact Gender: Male; Length: 7.21mm; Max Operating Temperature: 105°C; Strain Relief: No (Without); Contact Material: Bronze; Row Spacing: 2.54mm; Series: AMPMODU MOD II; Board Standoff: No (Without); Package Quantity: 520; Radiation Hardening: No; Contact Protection: No (Without); Stabilizers: No (Without); Number of Rows: 1; Contact Mating Length: 8.08mm; Contact Shape: Square; Depth: 2.54mm; Contact Current Rating: 3A; Flammability Rating: UL94 V-0; Packaging: Carton; Number of Contacts: 3; Orientation: Straight; Mount: Through Hole; Keyed: No; Contact Type: Male Pin; Housing Material: Thermoplastic; High Temperature Housing: No; ELV: Compliant; Contact Plating: Gold; Termination: Through Hole; Selectively Loaded: No (Without); Lead Free: Lead Free; Min Operating Temperature: -65°C; Mating Connector Lock: No (Without); Color: Black; RoHS Compliant: Yes
J13-J32 = CMP-02766-001428-1: CONN HEADER VERT 2POS 2.54MM; Voltage Rating: 550V; Current Rating: 7.6A; Gender: Male; Number of Contacts: 2; Connector Type: Male Pin; Radiation Hardening: No; Orientation: Straight; Contact Plating: Gold; Max Operating Temperature: 125°C; Mount: Through Hole; Package Quantity: 1; Number of Rows: 1; Housing Material: Polyester; RoHS Compliant: Yes; Length: 5.08mm; Max Voltage Rating (AC): 550V; Pitch: 2.54mm; Packaging: Bulk; Depth: 2.54mm; Termination: Solder; Min Operating Temperature: -55°C; Housing Color: Black; Lead Free: Lead Free; Color: Black; Number of Positions: 2; Width: 2.54mm; Max Current Rating: 7.6A; REACH SVHC: No SVHC; Contact Material: Bronze; Contact Mating Length: 0.23inch; Series: TSW; Contact Type: Male Pin
J40-J42 = CMP-73906-000017-1: CONN BANANA JACK TURRET BLUE; Voltage Rating (DC): 60V; Voltage Rating: 2.5kV; Insulation: Mating End Insulated; Current Rating: 15A; Gender: Female; Body Material: Polyphenylene; Insulation Material: Polycarbonate; Contact Material: Brass; Contact Plating: Nickel; Lead Free: Lead Free; Mount: Panel; Color: Blue; Series: -; Termination: Turret; Package Quantity: 1; REACH SVHC: No SVHC; Packaging: Bag; RoHS Compliant: Yes; Number of Pins: 1
J43 = CMP-002-00007-2: Female 3.5 mm Phone Jack, 5 Position, Height 5 mm, RoHS, Tape and Reel; Manufacturer: Switchcraft; Shielding: Unshielded; Connector Type: Audio; Max Current Rating: 3A; Voltage Rating: 250V; Datasheet Version: Rev. C, 07/2014; Case/Package: 35RASMT4BHNTRX; Gender: Female; Package Description: Female 3.5 mm Phone Jack, 5 Position, Height 5 mm; Max Operating Temperature: 85°C; Colour: Black; Manufacturer URL: http://www.switchcraft.com/; Package Reference: 35RASMT4BHNTRX; Packaging: TapeandReel; Pins: 3; Mounting Technology: SM; Min Operating Temperature: -25°C; Contact Material: Copper; Datasheet URL: http://www.switchcraft.com/Drawings/35rasmt4bhntrx_cd.pdf; Contact Plating: Silver; Current Rating: 3A; RoHS Compliant: True; Package Quantity: 800
R5 R10 R15 = CMP-009-00175-3: 20k 0603; Pins: 2; Min Operating Temperature: -55°C; Max Operating Temperature: 155°C; Case/Package: 0603
R9 R12 R16 = CMP-009-00175-3: 80k 0603; Pins: 2; Min Operating Temperature: -55°C; Max Operating Temperature: 155°C; Case/Package: 0603
R17 R18 = CMP-009-00175-3: 1k 0603; Pins: 2; Min Operating Temperature: -55°C; Max Operating Temperature: 155°C; Case/Package: 0603
R19 R20 = CMP-009-00175-3: 12k 0603; Pins: 2; Min Operating Temperature: -55°C; Max Operating Temperature: 155°C; Case/Package: 0603
R21-R24 = CMP-009-00175-3: 10k 0603; Pins: 2; Min Operating Temperature: -55°C; Max Operating Temperature: 155°C; Case/Package: 0603
U7 = CMP-0017-00003-2: Quad Low-Noise JFET-Input General-Purpose Operational Amplifier, 7 to 36 V, 0 to 70 degC, 14-pin SOIC (D14), Green (RoHS & no Sb/Br); Manufacturer: Texas Instruments; Slew Rate(Typ)(V/us): 13; IIB(Max)(pA): 200; Number of Channels: 4; CMRR(Min)(dB): 70; Vn at 1kHz(Typ)(nV/rtHz): 18; Vio (25C)(Max)(mV): 10; Sub Family: General Purpose Amplifier, High Supply Voltage Amplifier (>=30V); Total Supply Voltage(Max)(+5V is 5, +/-5V is 10): 36; Total Supply Voltage(Min)(+5V is 5, +/-5V is 10): 7; GBW(Typ)(MHz): 3; Rating: Military; Iq per channel(Max)(mA): 2.5; Eco-Plan: Green (RoHS & no Sb/Br); ComponentLink3Description: Package Specification; ComponentLink1URL: http://www.ti.com/; Mounting Technology: Surface Mount; ComponentLink3URL: http://www.ti.com/lit/ml/mpds177g/mpds177g.pdf; PartNumber: TL074CDR; DatasheetVersion: SLOS080J; ComponentLink2URL: http://www.ti.com/lit/ds/symlink/tl074.pdf; ComponentLink1Description: Manufacturer URL; PackageVersion: 4040047-5/M, 06/2011; PackageReference: D0014A; Code_JEDEC: MS-012; ComponentLink2Description: Datasheet; Offset Drift(Typ)(uV/C): 18; PackageDescription: 14-Pin Plastic Small Outline, Body 8.65 x 3.90 mm, Pitch 1.27 mm

## Nets that join several sheets
GND: NUCLEO (10 pins), DAC (61 pins), IO (65 pins)
NetA1_CN8_9: NUCLEO (A1.CN8_9), DAC (U1.1 U4.1)
NetA1_CN8_15: NUCLEO (A1.CN8_15), IO (5 pins)
NetA1_CN9_1: NUCLEO (A1.CN9_1), IO (C231.2 R21.2 R22.1)
NetA1_CN9_16: NUCLEO (A1.CN9_16), DAC (U2.28 U5.28)
NetA1_CN9_19: NUCLEO (A1.CN9_19), DAC (R6.2 R13.2 U2.44 U5.44)
NetA1_CN9_20: NUCLEO (A1.CN9_20), DAC (U2.38)
NetA1_CN9_21: NUCLEO (A1.CN9_21), DAC (J35.3 J38.3 R7.2 R14.2)
NetA1_CN9_22: NUCLEO (A1.CN9_22), DAC (U5.38)
NetA1_CN10_29: NUCLEO (A1.CN10_29), IO (C232.2 R23.1 R24.2)
NetC3_2: DAC (21 pins), IO (R21.1 R24.1)
NetR2_1: NUCLEO (R2.1), DAC (U2.17 U5.17)
NetR3_1: NUCLEO (R3.1), DAC (U2.27 U5.27)